# EAGLE design Wio - Expansion Board_RevB (EAGLE 9.6.2)
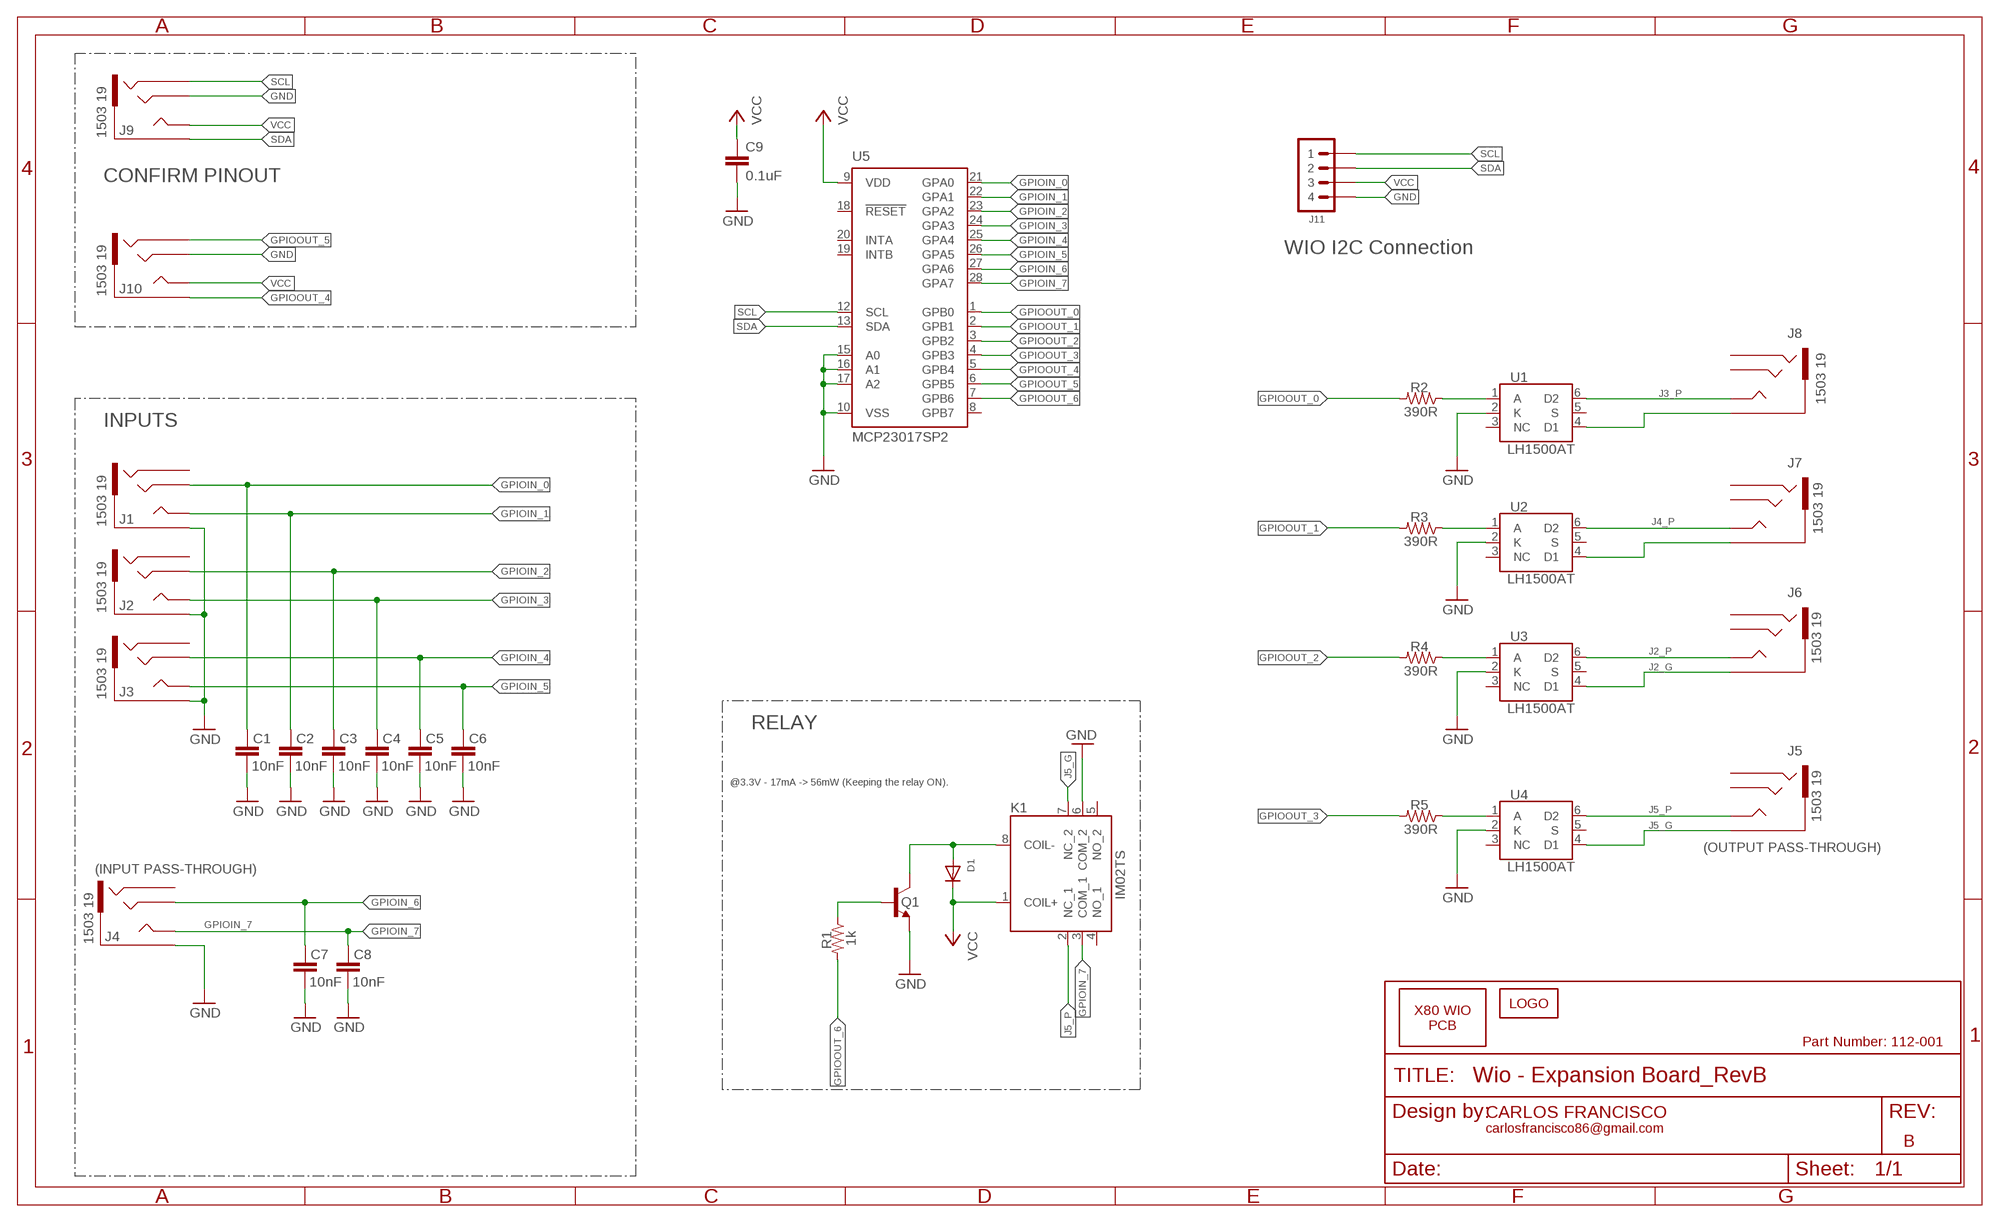
[diagram p0: schematic, sheet 1]

## Parts
C1  10nF  C-2.5P-2.4X4.4  [C025-024X044]
C2  10nF  C-2.5P-2.4X4.4  [C025-024X044]
C3  10nF  C-2.5P-2.4X4.4  [C025-024X044]
C4  10nF  C-2.5P-2.4X4.4  [C025-024X044]
C5  10nF  C-2.5P-2.4X4.4  [C025-024X044]
C6  10nF  C-2.5P-2.4X4.4  [C025-024X044]
C7  10nF  C-2.5P-2.4X4.4  [C025-024X044]
C8  10nF  C-2.5P-2.4X4.4  [C025-024X044]
C9  0.1uF  C-EU025-025X050  [C025-025X050]
D1  1N4148  DIODE-DO-35  [DO-1N4148]
J1  1503 19  STEREO_JACK-1503-19  [1503-19]
J2  1503 19  STEREO_JACK-1503-19  [1503-19]
J3  1503 19  STEREO_JACK-1503-19  [1503-19]
J4  1503 19  STEREO_JACK-1503-19  [1503-19]
J5  1503 19  STEREO_JACK-1503-19  [1503-19]
J6  1503 19  STEREO_JACK-1503-19  [1503-19]
J7  1503 19  STEREO_JACK-1503-19  [1503-19]
J8  1503 19  STEREO_JACK-1503-19  [1503-19]
J9  1503 19  STEREO_JACK-1503-19  [1503-19]
J10  1503 19  STEREO_JACK-1503-19  [1503-19]
J11  4P-2.0-90D  CONN_04-GROOVE-RA-THT  [HW4-2.0-90D]
K1  IM02TS  IM02TS  [IM03TS114620378]
LOGO1  LOGO-10MM  [LOGO_10MM]
PCB2  X80_WIO_PCB-WIO_PCB_V1  [WIO_PCB]
Q1  PN2222A  NPN-TO-92  [TO92-EBC-OVAL]
R1  1k  R-0206-THT-RS  [0204/7]
R2  390R  R-0206-THT-RS  [0204/7]
R3  390R  R-0206-THT-RS  [0204/7]
R4  390R  R-0206-THT-RS  [0204/7]
R5  390R  R-0206-THT-RS  [0204/7]
U1  LH1500AT  SSR-LH1500AT  [DIP762W47P254L880H410Q6N]
U2  LH1500AT  SSR-LH1500AT  [DIP762W47P254L880H410Q6N]
U3  LH1500AT  SSR-LH1500AT  [DIP762W47P254L880H410Q6N]
U4  LH1500AT  SSR-LH1500AT  [DIP762W47P254L880H410Q6N]
U5  MCP23017SP2  [DIL28-3-ROUND]

## Nets
GND: C1.2 C2.2 C3.2 C4.2 C5.2 C6.2 C7.2 C8.2 C9.2 J1.1 J2.1 J3.1 J4.1 J9.3 J10.3 J11.4 K1.6(COM_2) Q1.E U1.2(K) U2.2(K) U3.2(K) U4.2(K) U5.10(VSS) U5.15(A0) U5.16(A1) U5.17(A2)
GPIOIN_0: C1.1 J1.3 U5.21(GPA0)
GPIOIN_1: C2.1 J1.4 J1.5 U5.22(GPA1)
GPIOIN_2: C3.1 J2.3 U5.23(GPA2)
GPIOIN_3: C4.1 J2.4 J2.5 U5.24(GPA3)
GPIOIN_4: C5.1 J3.3 U5.25(GPA4)
GPIOIN_5: C6.1 J3.4 J3.5 U5.26(GPA5)
GPIOIN_6: C7.1 J4.3 U5.27(GPA6)
GPIOIN_7: C8.1 J4.4 J4.5 K1.3(COM_1) U5.28(GPA7)
GPIOOUT_0: R2.1 U5.1(GPB0)
GPIOOUT_1: R3.1 U5.2(GPB1)
GPIOOUT_2: R4.1 U5.3(GPB2)
GPIOOUT_3: R5.1 U5.4(GPB3)
GPIOOUT_4: J10.1 U5.5(GPB4)
GPIOOUT_5: J10.2 U5.6(GPB5)
GPIOOUT_6: R1.1 U5.7(GPB6)
J2_G: J6.1 U3.4(D1)
J2_P: J6.4 J6.5 U3.6(D2)
J3_P: J8.4 J8.5 U1.6(D2)
J4_P: J7.4 J7.5 U2.6(D2)
J5_G: J5.1 K1.7(NC_2) U4.4(D1)
J5_P: J5.4 J5.5 K1.2(NC_1) U4.6(D2)
N$2: J8.1 U1.4(D1)
N$3: J7.1 U2.4(D1)
N$6: R2.2 U1.1(A)
N$8: R3.2 U2.1(A)
N$9: R4.2 U3.1(A)
N$10: R5.2 U4.1(A)
N$14: D1.A K1.8(COIL-) Q1.C
N$19: Q1.B R1.2
SCL: J9.2 J11.1 U5.12(SCL)
SDA: J9.1 J11.2 U5.13(SDA)
VCC: C9.1 D1.C J9.4 J9.5 J10.4 J10.5 J11.3 K1.1(COIL+) U5.9(VDD)
Unconnected: J1.2 J2.2 J3.2 J4.2 J5.2 J5.3 J6.2 J6.3 J7.2 J7.3 J8.2 J8.3 K1.4(NO_1) K1.5(NO_2) U1.3(NC) U1.5(S) U2.3(NC) U2.5(S) U3.3(NC) U3.5(S) U4.3(NC) U4.5(S) U5.8(GPB7) U5.18(!RESET) U5.19(INTB) U5.20(INTA)

## Notes on the sheet
- CONFIRM PINOUT
- WIO I2C Connection
- INPUTS
- RELAY
- @3.3V - 17mA -> 56mW (Keeping the relay ON).
- (OUTPUT PASS-THROUGH)
- (INPUT PASS-THROUGH)
- Part Number: 112-001
- CARLOS FRANCISCO
- carlosfrancisco86@gmail.com
- B

## Library data of the parts
C1-C8 = AceCenter:C
C9 = rcl:C-EU: CAPACITOR, European symbol; SPICEPREFIX: C
D1 = AceCenter:DIODE: General purpose diode; DESCRIPTION: Switching Diode, 400mA 100V, 2-Pin DO-35; MFR: ON Semiconductor; MFR_NUM: 1N4148TR; VENDOR_NUM: 671-5477
J1-J10 = AceCenter:STEREO_JACK: 3.5 mm PCB Mount Stereo Jack Socket; DESCRIPTION: Lumberg 3.5 mm PCB Mount Stereo Jack Socket, 4Pole 1A; MFR: Lumberg; MFR_NUM: 1503 19; VENDOR: RS-ONLINE; VENDOR_NUM: 124-8885
J11 = AceCenter:CONN_04
K1 = AceCenter:IM02TS: DPDT telecom PCB relay, 2A 5Vdc coil, EA Source: Datasheet <http://uk.rs-online.com/web/p/products/4227029>; DESCRIPTION: DPDT telecom PCB relay, 2A 5Vdc coil, EA; MFR: TE Connectivity; MFR_NUM: IM02TS; VENDOR: RS-ONLINE; VENDOR_NUM: 422-7013
LOGO1 = AceCenter:LOGO
PCB2 = AceCenter:X80_WIO_PCB
Q1 = AceCenter:NPN; DESCRIPTION: NPN General-Purpose Amplifier; MFR: ON Semiconductor; MFR_NUM: PN2222ABU; VENDOR: RS-ONLINE; VENDOR_NUM: 739-0555
R1-R5 = AceCenter:R: SMD Resistor
U1-U4 = AceCenter:SSR: Vishay 1 Form A Solid-State Relay (Normally Open); DESCRIPTION: 1 Form A Solid-State Relay (NO); MFR: Vishay; MFR_NUM: LH1500AT; VENDOR: RS-ONLINE; VENDOR_NUM: 180-8794
U5 = AceCenter:MCP23017: http://ww1.microchip.com/downloads/en/DeviceDoc/21952a.pdf Source: http://ww1.microchip.com/downloads/en/DeviceDoc/21952a.pdf

## Board
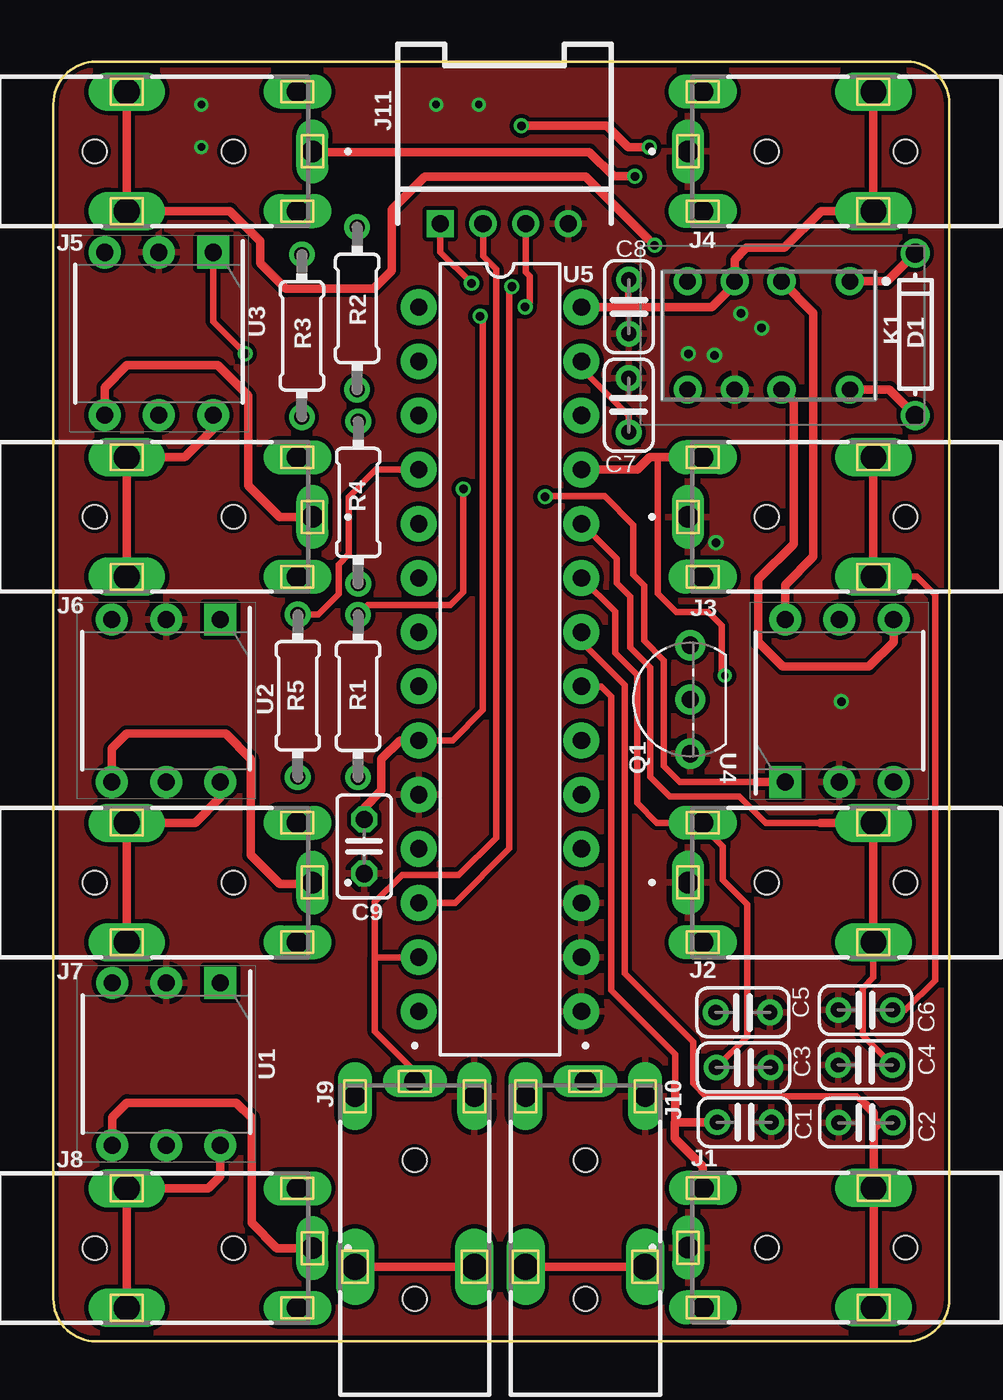
[diagram p1: board, top side]
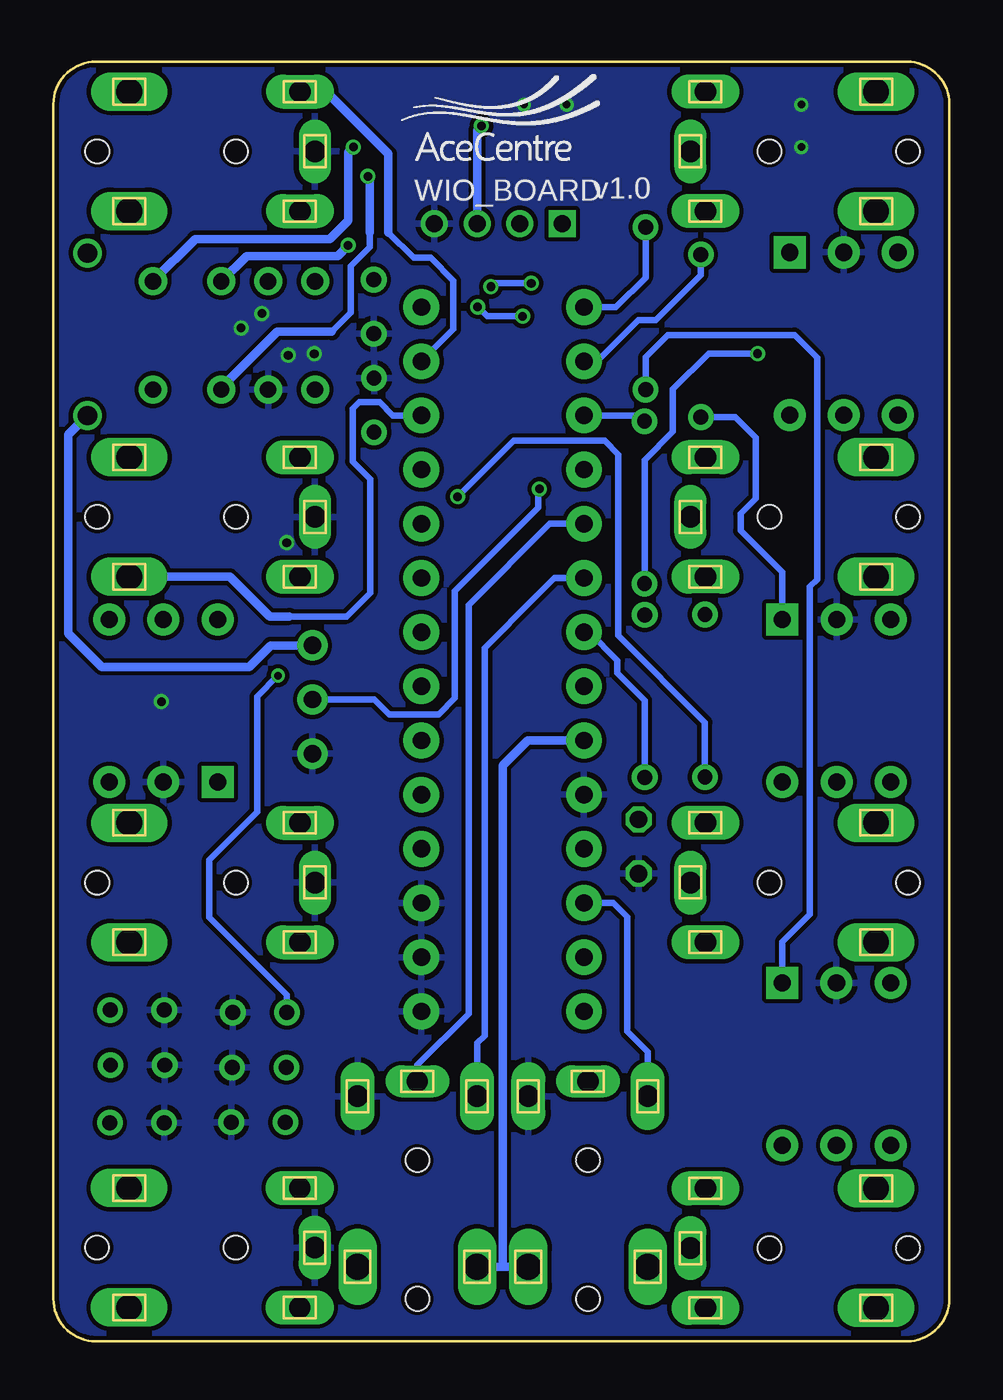
[diagram p2: board, bottom side, seen from below]

Size 42 x 60 mm. Coordinates in mm from the lower left corner, seen from the top.
Copper layers (1*16): Top 0.035mm / dielectric 1.5mm / Bottom 0.035mm
Design rules "SparkFun-2-layer-PCBWay-LIMIT": minimum track width 6mil, minimum drill 0.3mm, track to track 6mil, track to pad 6mil, pad to pad 6mil, via to via 6mil, smd to smd 6mil, copper to edge 6mil, drill to drill 6mil, minimum pad ring 6mil, minimum via ring 6mil, stop-mask expansion 4mil, vias tented up to drill 25mil, thermal gap 10mil

### Footprints (pad centres in the part's own frame; a part is rotated, then mirrored left to right if it is on the bottom)
C025-024X044 = drill 0.7 pad 1.2: 1 -1.27,0; 2 1.27,0
C025-025X050 = drill 0.813 octagon: 1 -1.27,0; 2 1.27,0
DO-1N4148 = drill 0.9: A -3.81,0; C 3.81,0
1503-19 = drill 1 pad 1.5 long: 1 14.7,0 | drill 1 pad 1.6 long: 2 14,2.8; 3 14,-2.8 | drill 1.2 pad 1.8 long: 4 6,2.8; 5 6,-2.8 | hole 1.1: 4.5,0; 11,0
HW4-2.0-90D = drill 0.8 pad 1.27 square: 1 -3,0 | drill 0.8 pad 1.27: 2 -1,0; 3 1,0; 4 3,0
IM03TS114620378 = drill 0.77 pad 1.32: 1 0,0; 2 3.2,0; 3 5.4,0; 4 7.6,0; 5 7.6,5.08; 6 5.4,5.08; 7 3.2,5.08; 8 0,5.08
TO92-EBC-OVAL = drill 0.813 pad 1.422: B 0,-1.27; C 2.54,-1.27; E -2.54,-1.27
0204/7 = drill 0.7 pad 1.2: 1 -3.81,0; 2 3.81,0
DIP762W47P254L880H410Q6N = drill 0.8 pad 1.5 square: 1 -3.81,2.54 | drill 0.8 pad 1.5: 2 -3.81,0; 3 -3.81,-2.54; 4 3.81,-2.54; 5 3.81,0; 6 3.81,2.54
DIL28-3-ROUND = drill 0.813 pad 1.676: 1 -16.51,-3.81; 2 -13.97,-3.81; 3 -11.43,-3.81; 4 -8.89,-3.81; 5 -6.35,-3.81; 6 -3.81,-3.81; 7 -1.27,-3.81; 8 1.27,-3.81; 9 3.81,-3.81; 10 6.35,-3.81; 11 8.89,-3.81; 12 11.43,-3.81; 13 13.97,-3.81; 14 16.51,-3.81; 15 16.51,3.81; 16 13.97,3.81; 17 11.43,3.81; 18 8.89,3.81; 19 6.35,3.81; 20 3.81,3.81; 21 1.27,3.81; 22 -1.27,3.81; 23 -3.81,3.81; 24 -6.35,3.81; 25 -8.89,3.81; 26 -11.43,3.81; 27 -13.97,3.81; 28 -16.51,3.81

### Placement (x,y rotation side)
C1  32.39,10.27 0 top
C2  38.08,10.25 180 top
C3  32.35,12.84 0 top
C4  38.05,12.95 180 top
C5  32.32,15.42 0 top
C6  38.07,15.53 180 top
C7  26.97,43.89 90 top
C8  26.98,48.51 270 top
C9  14.57,23.2 270 top
D1  40.4,47.22 90 top
J1  44.45,4.39 180 top
J2  44.44,21.51 180 top
J3  44.44,38.65 180 top
J4  44.44,55.79 180 top
J5  -2.56,55.79 0 top
J6  -2.56,38.65 0 top
J7  -2.56,21.51 0 top
J8  -2.56,4.37 0 top
J9  16.94,-2.51 90 top
J10  24.94,-2.51 90 top
J11  21.14,52.41 0 top
K1  37.33,49.7 180 top
LOGO1  25.71,55.29 0 bottom
PCB2  0,0 0 top
Q1  28.59,30.09 90 top
R1  14.28,30.25 90 top
R2  14.24,48.43 270 top
R3  11.65,47.14 270 top
R4  14.29,39.33 270 top
R5  11.46,30.26 270 top
U1  5.29,13 270 top
U2  5.29,30.04 270 top
U3  4.95,47.25 270 top
U4  36.84,30.03 90 top
U5  20.94,31.98 270 top

### Tracks (layer width: path | path; a pad name or v marks a point on that pad's centre or on a via)
GND  (via drill 0.35, 0.4)
  other vias: 31.06,37.44 29.77,46.3 36.94,29.99 33.2,47.51 30.99,46.23 32.23,48.19 17.94,57.99 19.94,57.99 6.94,57.99 6.94,55.99
  pour Bottom (isolate 0.2): -0.06,57.99 -0.06,-0.32 39.2,-0.32 arc90 42.2,2.68 42.2,57.62 arc90 39.81,60.01 1.96,60.01 arc90
  pour Top (isolate 0.2): 42.2,57.6 42.2,-0.32 1.25,-0.32 arc-90 -0.06,0.99 -0.06,56.99 arc-90 2.99,60.04 39.76,60.04 arc-90
GPIOIN_0
  Top 0.3: U5.21 25.69,30.71 26.16,30.24 26.16,16.45 29.15,13.46 29.15,11.99
  Top 0.4: J1.3 30.45,8.2 29.13,9.52 29.13,10.27 29.15,10.27 | 29.15,11.99 29.15,10.27 | C1.1 29.15,10.27
GPIOIN_1
  Top 0.3: 38.05,11.11 37.66,11.5 30.59,11.5 29.99,12.1 29.99,14.04 26.78,17.24 26.78,30.78 24.75,32.81 U5.22
  Top 0.4: J1.4 J1.5 38.45,9.99 | C2.1 38.71,10.25 38.45,9.99 | 38.45,9.99 38.45,10.71 38.05,11.11
GPIOIN_2
  Top 0.3: U5.23 26.34,34.21 26.34,32.27 27.36,31.24 27.36,25.23 28.28,24.31 30.28,24.31 | J2.3 30.28,24.31 | C3.1 32.52,14.28 32.52,20.48 31.38,21.62 31.38,23.21 30.28,24.31
GPIOIN_3
  Top 0.3: 35.94,24.31 33.39,24.31 32.16,25.54 28.89,25.54 27.98,26.45 27.98,31.6 27.04,32.54 27.04,34.91 26.4,35.55 26.4,36.7 24.77,38.33 U5.24 | C4.1 37.93,14.34 37.93,16.54 38.44,17.05 J2.4
  Top 0.4: J2.4 J2.5 35.94,24.31
GPIOIN_4  (via drill 0.35)
  Top 0.3: v31.47,31.21 31.32,31.36 31.32,33.56 30.69,34.19 29.19,34.19 28.33,35.05 28.33,41.45
  Top 0.4: U5.25 27.38,40.87 27.96,41.45 28.33,41.45 J3.3
  Bottom 0.3: C5.1 31.05,16.24 34.69,19.88 34.69,22.58 32.45,24.82 32.45,30.23 v31.47,31.21
GPIOIN_5
  Top 0.3: J3.4 40.47,35.85 41.33,34.99 41.33,16.93 39.93,15.53 C6.1
  Top 0.4: J3.4 J3.5
  Bottom 0.3: 30.94,33.99 28.25,33.99 27.15,35.09 27.15,40.43 27.97,41.25 27.97,43.72 27.65,44.04 26.71,44.04 26.08,43.41 U5.26
  Bottom 0.4: J3.4 33.72,35.85 31.86,33.99 30.94,33.99
GPIOIN_6
  Top 0.3: C7.1 26.97,43.41 24.75,45.63 U5.27
  Bottom 0.3: 26.3,51.99 25.11,50.8 24.32,50.8 23.25,49.73 23.25,47.45 U5.27
  Bottom 0.4: J4.3 29.21,58.59 26.3,55.68 26.3,51.99
GPIOIN_7
  Top 0.3: C8.1 26.94,49.74 26.94,48.49
  Top 0.4: J4.5 J4.4 35.99,52.99 34.27,51.27 32.48,51.27 31.93,50.72 K1.3 31.93,49.56 30.86,48.49 26.94,48.49 U5.28
GPIOOUT_0
  Bottom 0.3: R2.1 14.24,49.88 15.63,48.49 U5.1
GPIOOUT_1
  Bottom 0.3: R3.1 11.65,49.99 13.76,47.88 14.58,47.88 16.51,45.95 U5.2
GPIOOUT_2
  Bottom 0.3: U5.3 14.56,43.41 R4.1
GPIOOUT_3
  Top 0.3: U5.4 15.12,40.87 13.84,39.59 13.84,36.9 13.37,36.43 13.37,35.03 12.41,34.07 R5.1
GPIOOUT_4
  Bottom 0.3: U5.5 18.73,38.33 22.53,34.53 22.53,15.36 24.94,12.95 J10.1
GPIOOUT_5
  Bottom 0.3: U5.6 18.51,35.79 19.12,35.18 19.41,34.89 21.79,32.51 21.79,14.33 22.14,13.98 J10.2
GPIOOUT_6
  Bottom 0.3: R1.1 14.28,30.05 15.56,31.33 15.56,31.93 16.88,33.25 U5.7
J2_G
  Top 0.4: J6.1 10.61,38.65 9.13,40.13 9.13,44.33 7.7,45.76 3.45,45.76 2.41,44.72 U3.4
J2_P
  Top 0.4: J6.5 J6.4 6.16,41.45 7.49,42.78 U3.6
J3_P
  Top 0.4: J8.5 J8.4 7.27,7.17 7.83,7.73 U1.6
J4_P
  Top 0.4: J7.5 J7.4 6.65,24.31 7.83,25.49 U2.6
J5_G  (via drill 0.4)
  Top 0.4: K1.7 34.7,44.05 34.7,37.39 33.05,35.74 33.05,32.78 34.2,31.63 38.23,31.63 39.38,32.78 U4.4 | v27.26,54.62 26.26,54.62 25.12,55.76 12.17,55.76 J5.1
  Bottom 0.3: 28.94,47.33 28.05,48.22 28.05,50.42 27.18,51.29 27.18,51.99
  Bottom 0.4: v27.26,54.62 27.18,54.54 27.18,51.99 | K1.7 34.13,44.71 31.51,47.33 28.94,47.33
J5_P  (via drill 0.4)
  Top 0.4: J5.4 J5.5 8.28,52.99 9.69,51.58 9.69,50.56 10.9,49.35 15.01,49.35 15.87,50.21 15.87,53.07 17.41,54.61 24.95,54.61 27.9,51.66 27.91,51.66 v28.18,51.39 | U4.6 34.3,35.47 35.62,36.79 35.62,48.21 K1.2
  Bottom 0.4: v28.18,51.39 28.68,50.89 32.94,50.89 K1.2
N$2
  Top 0.4: U1.4 2.75,10.49 3.45,11.19 8.58,11.19 9.29,10.48 9.29,5.55 10.47,4.37 J8.1
N$3
  Top 0.4: U2.4 2.75,27.8 3.44,28.49 8.07,28.49 9.25,27.31 9.25,22.8 10.61,21.44 12.07,21.44 J7.1
N$6
  Bottom 0.3: U1.1 7.83,18.73 6.54,20.02 6.54,35.38 6.2,35.72 6.2,46.12 7.26,47.18 13.2,47.18 14.24,46.14 R2.2
N$8
  Bottom 0.3: U2.1 7.83,36.06 9.78,38.01 9.78,38.82 9.08,39.52 9.08,42.37 10.04,43.33 R3.2
N$9  (via drill 0.4)
  Top 0.3: U3.1 7.49,48.07 7.49,47.81 v8.99,46.31
  Bottom 0.3: R4.2 14.29,41.32 12.96,42.65 12.96,44.64 11.29,46.31 v8.99,46.31
N$10  (via drill 0.4)
  Top 0.3: 32.94,26.22 29.37,26.22 28.62,26.97 28.62,31.93 27.69,32.86 27.69,35.43 27.17,35.95 27.17,37.56 27.19,37.58 27.19,38.28 25.84,39.63 23.08,39.63 v23.05,39.6
  Top 0.4: U4.1 32.94,26.22
  Bottom 0.3: R5.2 11.46,29.02 15.52,33.08 15.52,41.58 16.16,42.22 20.43,42.22 v23.05,39.6
N$14
  Top 0.4: 38.68,44.62 K1.8 39.18,44.62 D1.A
  Bottom 0.4: Q1.C 31.81,32.63 32.82,31.62 39.72,31.62 41.29,33.19 41.29,42.52 D1.A
N$19  (via drill 0.4)
  Top 0.3: v19.22,39.96 19.22,35.13 18.6,34.51 14.73,34.51 R1.2
  Bottom 0.3: Q1.B 26.95,30.09 26.26,29.4 23.94,29.4 23.18,30.16 23.18,33.99 23.18,34.38 23.18,35.17 19.26,39.09 19.26,39.92 v19.22,39.96
SCL  (via drill 0.4)
  Top 0.3: U5.12 18.83,20.55 21.38,23.1 21.38,49.34 v21.49,49.45 | J11.1 18.14,51.07 v19.6,49.61
  Bottom 0.3: J9.2 14.14,13.58 15.09,14.53 15.09,19.89 15.75,20.55 U5.12 | v19.6,49.61 21.33,49.61 v21.49,49.45
SDA
  Top 0.3: 16.16,18.01 U5.13 15.07,18.01 | 15.07,18.01 15.07,20.59 16.35,21.87 19.01,21.87 20.75,23.61 20.75,50.27 20.14,50.88 J11.2 | J9.1 16.94,12.65 15.07,14.52 15.07,18.01
VCC  (via drill 0.4)
  Top 0.3: U5.9 18.71,28.17 20.13,29.59 20.13,47.93 v20,48.06 | v22.11,48.5 22.34,48.73 22.34,49.94 22.14,50.14 J11.3
  Top 0.4: J9.4 J9.5 | J10.4 J10.5 | K1.1 39.08,49.7 D1.C | U5.9 16.25,28.17 15.38,27.3 15.38,25.82 14.57,25.01 C9.1 | v21.94,56.99 25.94,56.99 26.94,55.99 v27.94,55.99
  Bottom 0.3: v20,48.06 21.67,48.06 v22.11,48.5
  Bottom 0.4: J10.4 20.94,3.49 | 20.94,3.49 J9.5 | U5.9 19.76,28.17 20.94,26.99 20.94,3.49 | v27.94,55.99 28.18,55.75 28.18,52.54 29.04,51.68 35.35,51.68 K1.1 | J11.3 22.14,56.79 v21.94,56.99

### Text on the board
bPlace: v1.0 | WIO_BOARD